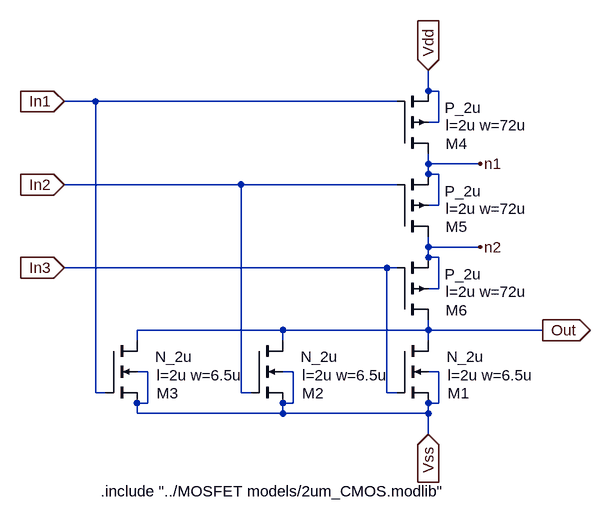
[diagram p0: schematic NOR3.asc]
NOR3.asc, the LTspice schematic file:
Version 4
SHEET 1 880 872
WIRE 192 -192 192 -224
WIRE 208 -192 192 -192
WIRE -320 -176 -368 -176
WIRE 144 -176 -320 -176
WIRE 208 -144 208 -192
WIRE 208 -144 192 -144
WIRE 192 -80 192 -96
WIRE 272 -80 192 -80
WIRE 192 -64 192 -80
WIRE 208 -64 192 -64
WIRE -96 -48 -368 -48
WIRE 144 -48 -96 -48
WIRE 208 -16 208 -64
WIRE 208 -16 192 -16
WIRE 192 48 192 32
WIRE 272 48 192 48
WIRE 192 64 192 48
WIRE 208 64 192 64
WIRE 128 80 -368 80
WIRE 144 80 128 80
WIRE 208 112 208 64
WIRE 208 112 192 112
WIRE -32 176 -256 176
WIRE 192 176 192 160
WIRE 192 176 -32 176
WIRE 368 176 192 176
WIRE -256 192 -256 176
WIRE -32 192 -32 176
WIRE 192 192 192 176
WIRE -240 240 -256 240
WIRE -16 240 -32 240
WIRE 208 240 192 240
WIRE -320 272 -320 -176
WIRE -304 272 -320 272
WIRE -96 272 -96 -48
WIRE -80 272 -96 272
WIRE 128 272 128 80
WIRE 144 272 128 272
WIRE -240 288 -240 240
WIRE -240 288 -256 288
WIRE -16 288 -16 240
WIRE -16 288 -32 288
WIRE 208 288 208 240
WIRE 208 288 192 288
WIRE -256 304 -256 288
WIRE -32 304 -32 288
WIRE -32 304 -256 304
WIRE 192 304 192 288
WIRE 192 304 -32 304
WIRE 192 336 192 304
FLAG 192 -224 Vdd
IOPIN 192 -224 In
FLAG 192 336 Vss
IOPIN 192 336 In
FLAG -368 -176 In1
IOPIN -368 -176 In
FLAG -368 -48 In2
IOPIN -368 -48 In
FLAG 368 176 Out
IOPIN 368 176 Out
FLAG -368 80 In3
IOPIN -368 80 In
FLAG 272 -80 n1
FLAG 272 48 n2
SYMBOL nmos4 144 192 R0
WINDOW 0 78 81 Left 2
WINDOW 3 76 25 Left 2
WINDOW 123 78 53 Left 2
SYMATTR InstName M1
SYMATTR Value N_2u
SYMATTR Value2 l=2u w=6.5u
SYMBOL pmos4 144 160 M180
WINDOW 0 75 15 Left 2
WINDOW 3 73 70 Left 2
WINDOW 123 75 43 Left 2
SYMATTR InstName M6
SYMATTR Value P_2u
SYMATTR Value2 l=2u w=72u
SYMBOL pmos4 144 32 M180
WINDOW 0 75 15 Left 2
WINDOW 3 73 70 Left 2
WINDOW 123 75 43 Left 2
SYMATTR InstName M5
SYMATTR Value P_2u
SYMATTR Value2 l=2u w=72u
SYMBOL nmos4 -304 192 R0
WINDOW 0 78 81 Left 2
WINDOW 3 76 25 Left 2
WINDOW 123 78 53 Left 2
SYMATTR InstName M3
SYMATTR Value N_2u
SYMATTR Value2 l=2u w=6.5u
SYMBOL pmos4 144 -96 M180
WINDOW 0 75 15 Left 2
WINDOW 3 73 70 Left 2
WINDOW 123 75 43 Left 2
SYMATTR InstName M4
SYMATTR Value P_2u
SYMATTR Value2 l=2u w=72u
SYMBOL nmos4 -80 192 R0
WINDOW 0 78 81 Left 2
WINDOW 3 76 25 Left 2
WINDOW 123 78 53 Left 2
SYMATTR InstName M2
SYMATTR Value N_2u
SYMATTR Value2 l=2u w=6.5u
TEXT -312 424 Left 2 !.include "../MOSFET models/2um_CMOS.modlib"

The netlist it stands for:
* NOR3.asc
M1 Out In3 Vss Vss N_2u l=2u w=6.5u
M6 Out In3 n2 n2 P_2u l=2u w=72u
M5 n2 In2 n1 n1 P_2u l=2u w=72u
M3 Out In1 Vss Vss N_2u l=2u w=6.5u
M4 n1 In1 Vdd Vdd P_2u l=2u w=72u
M2 Out In2 Vss Vss N_2u l=2u w=6.5u
.model NMOS NMOS
.model PMOS PMOS
.lib standard.mos
.include "../MOSFET models/2um_CMOS.modlib"
.backanno
.end